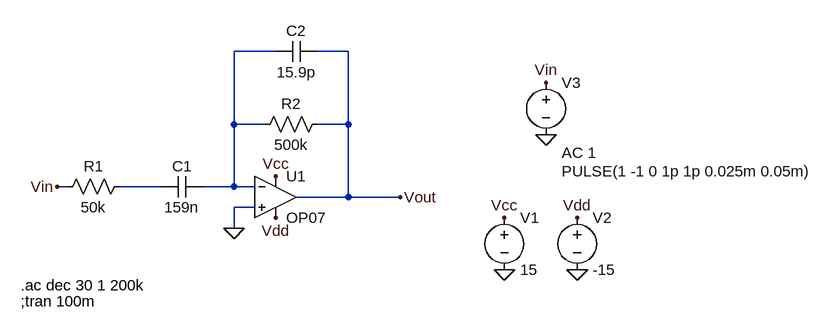
[diagram p0: schematic FFT.asc]
FFT.asc, the LTspice schematic file:
Version 4
SHEET 1 1220 680
WIRE 368 -48 304 -48
WIRE 480 -48 432 -48
WIRE 304 64 304 -48
WIRE 352 64 304 64
WIRE 480 64 480 -48
WIRE 480 64 432 64
WIRE 48 160 32 160
WIRE 192 160 128 160
WIRE 304 160 304 64
WIRE 304 160 256 160
WIRE 336 160 304 160
WIRE 480 176 480 64
WIRE 480 176 400 176
WIRE 560 176 480 176
WIRE 336 192 304 192
WIRE 304 224 304 192
FLAG 560 176 Vout
FLAG 304 224 0
FLAG 784 80 0
FLAG 720 288 0
FLAG 832 288 0
FLAG 368 208 Vdd
FLAG 832 208 Vdd
FLAG 720 208 Vcc
FLAG 368 144 Vcc
FLAG 32 160 Vin
FLAG 784 0 Vin
SYMBOL res 144 144 R90
WINDOW 0 0 56 VBottom 2
WINDOW 3 32 56 VTop 2
SYMATTR InstName R1
SYMATTR Value 50k
SYMBOL cap 256 144 R90
WINDOW 0 0 32 VBottom 2
WINDOW 3 32 32 VTop 2
SYMATTR InstName C1
SYMATTR Value 159n
SYMBOL res 448 48 R90
WINDOW 0 0 56 VBottom 2
WINDOW 3 32 56 VTop 2
SYMATTR InstName R2
SYMATTR Value 500k
SYMBOL cap 432 -64 R90
WINDOW 0 0 32 VBottom 2
WINDOW 3 32 32 VTop 2
SYMATTR InstName C2
SYMATTR Value 15.9p
SYMBOL Opamps\\OP07 368 112 R0
SYMATTR InstName U1
SYMBOL voltage 720 192 R0
WINDOW 123 0 0 Left 0
WINDOW 39 0 0 Left 0
SYMATTR InstName V1
SYMATTR Value 15
SYMBOL voltage 832 192 R0
WINDOW 123 0 0 Left 0
WINDOW 39 0 0 Left 0
SYMATTR InstName V2
SYMATTR Value -15
SYMBOL voltage 784 -16 R0
WINDOW 123 24 124 Left 2
WINDOW 39 0 0 Left 0
WINDOW 3 24 152 Left 2
SYMATTR Value2 AC 1
SYMATTR Value PULSE(1 -1 0 1p 1p 0.025m 0.05m)
SYMATTR InstName V3
TEXT -24 312 Left 2 !.ac dec 30 1 200k
TEXT -24 336 Left 2 !;tran 100m

The netlist it stands for:
* FFT.asc
R1 N002 Vin 50k
C1 N001 N002 159n
R2 Vout N001 500k
C2 Vout N001 15.9p
XU1 0 N001 Vcc Vdd Vout LT1001  ; OP07, pins In+ In- V+ V- OUT
V1 Vcc 0 15
V2 Vdd 0 -15
V3 Vin 0 PULSE(1 -1 0 1p 1p 0.025m 0.05m) AC 1
.ac dec 30 1 200k
;tran 100m
.lib LTC.lib
.backanno
.end